# Altium schematic sheet FPGA Inputs.SchDoc
size A
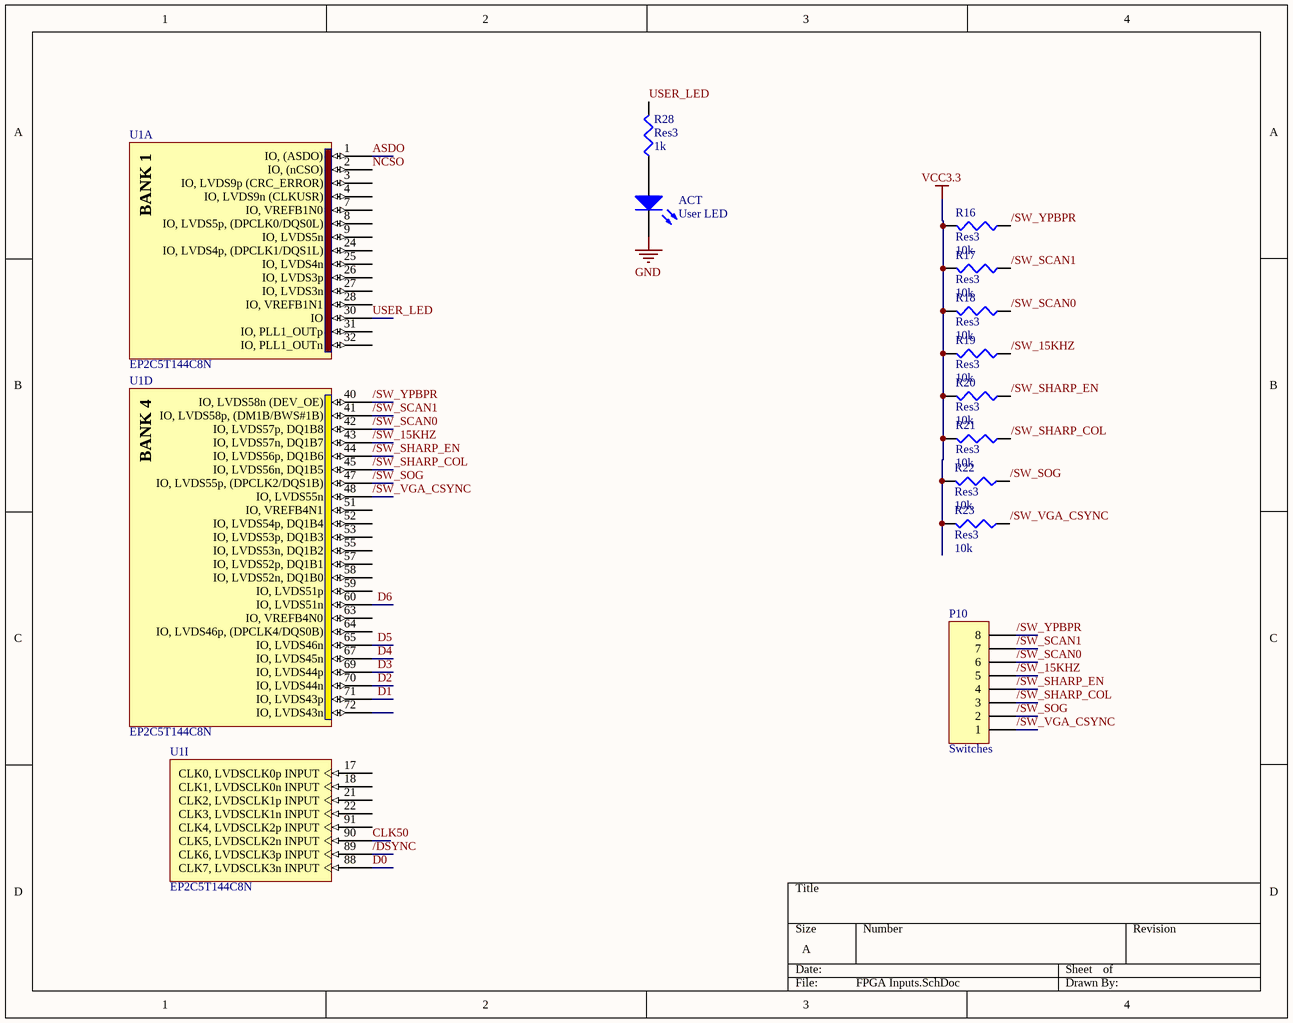
[diagram p0: FPGA Inputs.SchDoc]

## Parts
ACT  User LED  [1608[0603]]
P10  Switches  [HDR1X8]
R16  Res3  value 10k  [J1-0603]
R17  Res3  value 10k  [J1-0603]
R18  Res3  value 10k  [J1-0603]
R19  Res3  value 10k  [J1-0603]
R20  Res3  value 10k  [J1-0603]
R21  Res3  value 10k  [J1-0603]
R22  Res3  value 10k  [J1-0603]
R23  Res3  value 10k  [J1-0603]
R28  Res3  value 1k  [J1-0603]
U1  EP2C5T144C8N  [TQFP144_N]  (parts A,D,I of 9)

## Nets
GND: ACT.2(K)
VCC3.3: R16.2 R17.2 R18.2 R19.2 R20.2 R21.2 R22.2 R23.2
/DSYNC: U1.89(CLK6,_LVDSCLK3p_INPUT)
/SW_15KHZ: P10.5 R19.1 U1.43(IO,_LVDS57n,_DQ1B7)
/SW_SCAN0: P10.6 R18.1 U1.42(IO,_LVDS57p,_DQ1B8)
/SW_SCAN1: P10.7 R17.1 U1.41(IO,_LVDS58p,_(DM1B/BWS#1B))
/SW_SHARP_COL: P10.3 R21.1 U1.45(IO,_LVDS56n,_DQ1B5)
/SW_SHARP_EN: P10.4 R20.1 U1.44(IO,_LVDS56p,_DQ1B6)
/SW_SOG: P10.2 R22.1 U1.47(IO,_LVDS55p,_(DPCLK2/DQS1B))
/SW_VGA_CSYNC: P10.1 R23.1 U1.48(IO,_LVDS55n)
/SW_YPBPR: P10.8 R16.1 U1.40(IO,_LVDS58n_(DEV_OE))
ASDO: U1.1(IO,_(ASDO))
CLK50: U1.90(CLK5,_LVDSCLK2n_INPUT)
D0: U1.88(CLK7,_LVDSCLK3n_INPUT)
D1: U1.71(IO,_LVDS43p)
D2: U1.70(IO,_LVDS44n)
D3: U1.69(IO,_LVDS44p)
D4: U1.67(IO,_LVDS45n)
D5: U1.65(IO,_LVDS46n)
D6: U1.60(IO,_LVDS51n)
NCSO: U1.2(IO,_(nCSO))
USER_LED: R28.2 U1.30(IO)
NetACT_1: ACT.1(A) R28.1

Not connected (* = marked no-connect by the designer): U1 3(IO,_LVDS9p_(CRC_ERROR)) 4(IO,_LVDS9n_(CLKUSR)) 7(IO,_VREFB1N0) 8(IO,_LVDS5p,_(DPCLK0/DQS0L)) 9(IO,_LVDS5n) 17(CLK0,_LVDSCLK0p_INPUT) 18(CLK1,_LVDSCLK0n_INPUT) 21(CLK2,_LVDSCLK1p_INPUT) 22(CLK3,_LVDSCLK1n_INPUT) 24(IO,_LVDS4p,_(DPCLK1/DQS1L)) 25(IO,_LVDS4n) 26(IO,_LVDS3p) 27(IO,_LVDS3n) 28(IO,_VREFB1N1) 31(IO,_PLL1_OUTp) 32(IO,_PLL1_OUTn) 51(IO,_VREFB4N1) 52(IO,_LVDS54p,_DQ1B4) 53(IO,_LVDS53p,_DQ1B3) 55(IO,_LVDS53n,_DQ1B2) 57(IO,_LVDS52p,_DQ1B1) 58(IO,_LVDS52n,_DQ1B0) 59(IO,_LVDS51p) 63(IO,_VREFB4N0) 64(IO,_LVDS46p,_(DPCLK4/DQS0B)) 72(IO,_LVDS43n) 91(CLK4,_LVDSCLK2p_INPUT)

## Notes on the sheet
- (in symbol EP2C5T144C8N, part A) BANK 1
- (in symbol EP2C5T144C8N, part D) BANK 4

## Library data of the parts
ACT = LED2: Typical RED, GREEN, YELLOW, AMBER GaAs LED; Published: 8-Jun-2000; LatestRevisionDate: 17-Jul-2002; LatestRevisionNote: Re-released for DXP Platform.; PackageVersion: Feb-2002; PackageReference: 3.2X1.6X1.1; Publisher: Altium Limited; PackageDescription: SM LED; 2 Flat Leads
P10 = Header 8: Header, 8-Pin; LatestRevisionDate: 17-Jul-2002; LatestRevisionNote: Re-released for DXP Platform.; Publisher: Altium Limited
R16-R23 R28 = Res3: Resistor; Published: 8-Jun-2000; LatestRevisionDate: 29-May-2009; LatestRevisionNote: IPC-7351 Footprint Added.; PackageReference: J1-0603; Publisher: Altium Limited; PackageDescription: Chip Resistor
U1 = EP2C5T144C8N: Cyclone II Family, 1.2V FPGA, 89 I/O Pins, 2 PLLs, 144-Pin TQFP, Speed Grade 8, Commercial Grade, Pb-Free; Published: 4-Mar-2005; LatestRevisionDate: 14-May-2007; LatestRevisionNote: DATA0 pin is now INPUT.; DatasheetVersion: ver3.3, Feb-2008; PackageVersion: ver15.4, Dec-2008; PackageReference: TQFP144; Publisher: Altium Limited; PackageDescription: 144-Pin Plastic Thin Quad Flat Pack (TQFP144) - Wire Bond; Supplier 1: Digi-Key; Supplier Part Number 1: 544-1665-ND; Supplier 2: Farnell; Supplier Part Number 2: 1662263; Supplier 3: Farnell; Supplier Part Number 3: 1453497; Code_JEDEC: MS-026-BFB; ComponentLink1Description: Manufacturer Link; ComponentLink1URL: http://www.altera.com/products/devices/cyclone2/cy2-index.jsp; ComponentLink2Description: Handbook; ComponentLink2URL: http://www.altera.com/literature/hb/cyc2/cyc2_cii5v1.pdf; ComponentLink3Description: Packaging Specification; ComponentLink3URL: http://www.altera.com/literature/ds/dspkg.pdf